# EasyEDA Pro project card.epro

# Schematic Schematic1
Board Name: Board1; Create Date: 2024-08-14; Page Name: P1; Project Name: nfc card; Schematic Name: Schematic1; Update Date: 2025-07-19; Company: EasyEDA.com; Drawn: EasyEDA; Page Size: A4; Part Number: JLCPCB-002; Reviewed: EasyEDA; Version: V0.1
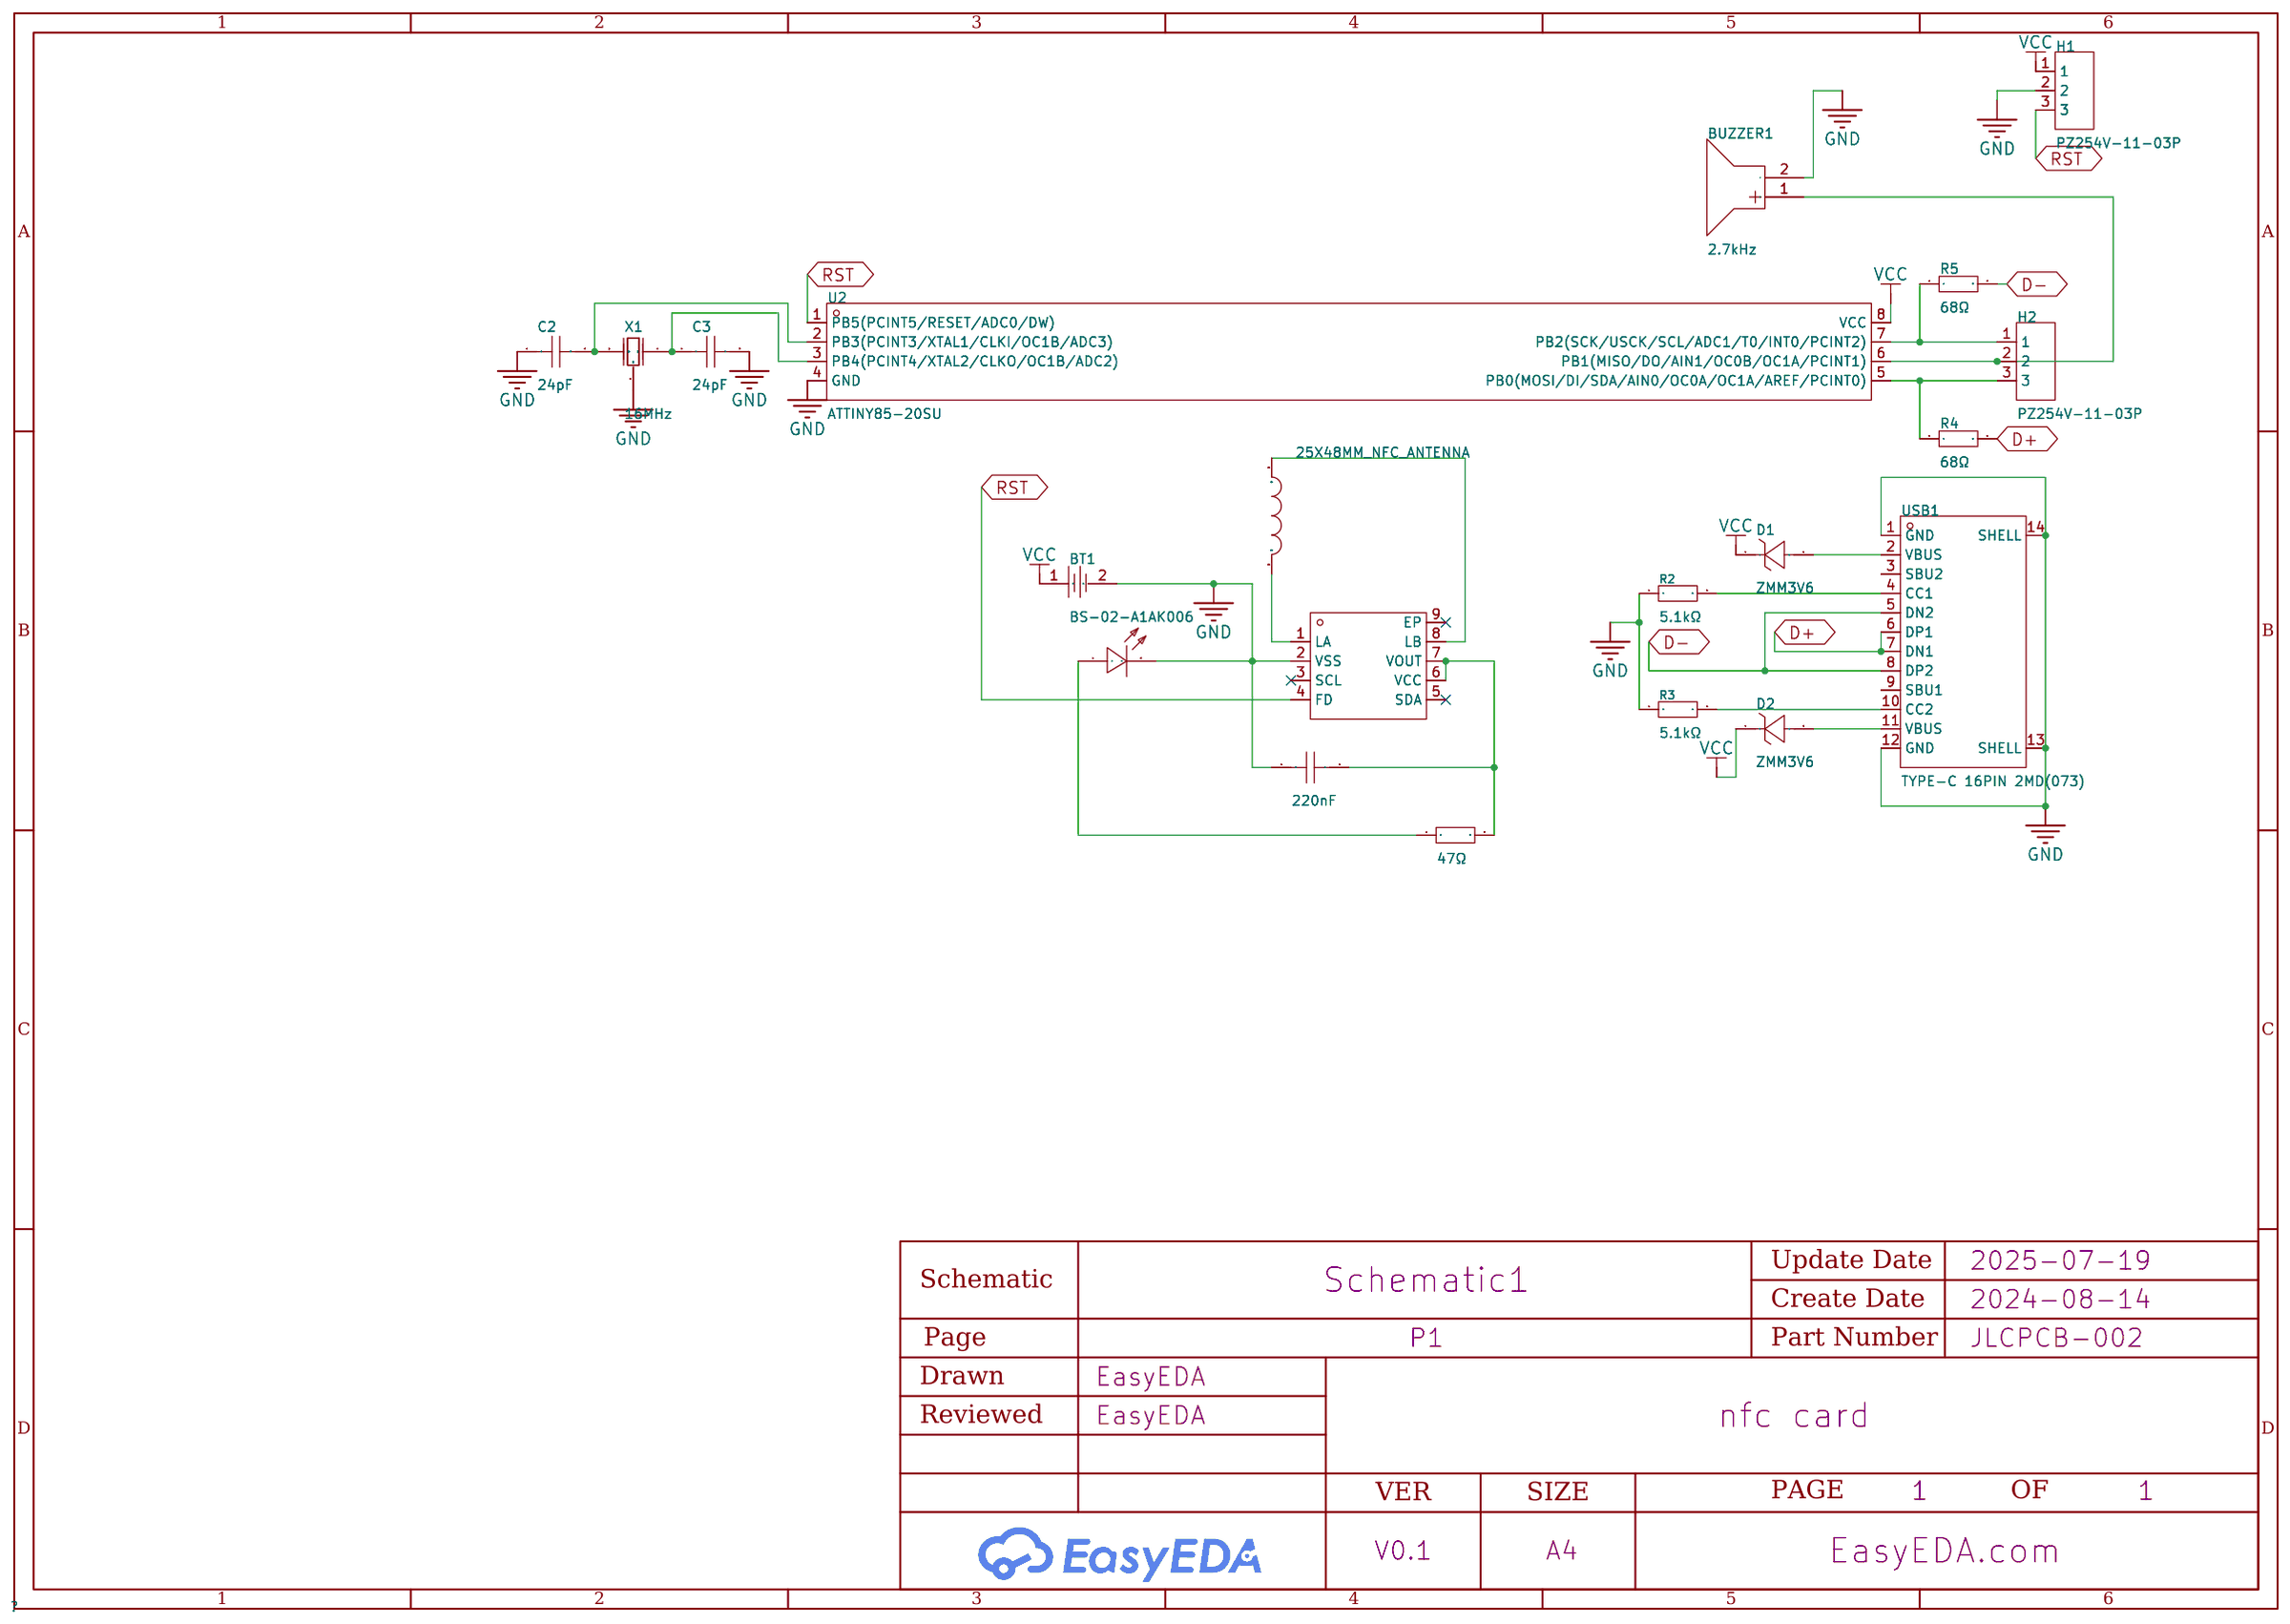
[diagram p0: schematic sheet]

## Parts
1  25X48MM_NFC_ANTENNA  [13.56MHZ CLASS 6 NFC ANTENNA]
BT1  BS-02-A1AK006  [BAT-TH_BS-02-A1AK006]
BUZZER1  2.7kHz  [BUZ-SMD_L9.6-W9.6-LS10.0-R]
C1  100nF  [C0805]
C2  24pF  [C0402]
C3  24pF  [C0402]
D1  ZMM3V6  [LL-34_L3.5-W1.5-RD]
D2  ZMM3V6  [LL-34_L3.5-W1.5-RD]
H1  PZ254V-11-03P  [HDR-TH_3P-P2.54-V-M]
H2  PZ254V-11-03P  [HDR-TH_3P-P2.54-V-M]
LED1  KT-0805YG  [LED0805-R-RD]
R1  47  [R0805]
R2  5.1kΩ  [R0402]
R3  5.1kΩ  [R0402]
R4  68Ω  [R0402]
R5  68Ω  [R0402]
U1  13.56MHz  [XQFN-8_L1.6-W1.6-P0.50-BL]
U2  ATTINY85-20SU  [SOIC-8_L5.3-W5.3-P1.27-LS8.0-BL]
USB1  TYPE-C 16PIN 2MD(073)  [USB-C-SMD_TYPE-C-6PIN-2MD-073]
X1  16MHz  [OSC-SMD_3P-L3.2-W1.3-P1.2-L]

## Library data of the parts
1 = 25X48MM_NFC_ANTENNA
BT1 = BS-02-A1AK006: Connector Type:Battery holder Battery Type:CR2032 Contact Material:Phosphor Bronze Contact Plating:Tin Operating Temperature Range:-25℃~+85℃ Operating Temperature Range:-25℃~+85℃; LCSC Part Name: 电池底座 适用电池:CR2032; Supplier Part: C964746; Manufacturer: MYOUNG(美阳); Supplier Footprint: 插件; JLCPCB Part Class: Extended Part; Datasheet: https://atta.szlcsc.com/upload/public/pdf/source/20201218/C964746_D636BD2F273EEE7B636B6EF7E90F8FC5.pdf; Supplier: LCSC; Connector Type: Battery holder; Battery Type: CR2032; Contact Material: Phosphor Bronze; Contact Plating: Tin; Operating Temperature Range: -25℃~+85℃
BUZZER1 = YS-SBZ9650DYB05: Driver Circuitry:Active (Built-in Driver Circuit) Voltage - Supply:3V~7V Voltage - Supply:3V~7V Frequency:2.7kHz Sound Pressure Level(SPL):80dB Length:9.6mm Width:9.6mm Height:5.3mm; LCSC Part Name: 贴片有源蜂鸣器5V; Supplier Part: C409830; Manufacturer: Fengming(锋鸣电子); Supplier Footprint: SMD,9.6x9.6mm; JLCPCB Part Class: Extended Part; Datasheet: https://atta.szlcsc.com/upload/public/pdf/source/20191217/C409830_8EC3C70066086F723D62F9967ED58A07.pdf; Supplier: LCSC; Driver Circuitry: Active (Built-in Driver Circuit); Voltage - Supply: 3V~7V; Sound Pressure Level(SPL): 80dB; Length: 9.6mm; Width: 9.6mm; Height: 5.3mm
C1 = C0805B104K500NT: Capacitance: Tolerance:±10% Tolerance:±10% Voltage Rated: Temperature Coefficient:; LCSC Part Name: 100nF ±10% 50V; Supplier Part: C476766; Manufacturer: TORCH(火炬); Supplier Footprint: 0805; JLCPCB Part Class: Extended Part; Datasheet: https://atta.szlcsc.com/upload/public/pdf/source/20191230/C476766_171E30D5B7F7164A8210B8E948DFBAE0.pdf; Supplier: LCSC; Tolerance: ±10%
C2 C3 = GJM1555C1H240JB01D: Capacitance:24pF Tolerance:±5% Tolerance:±5% Voltage Rating:50V Temperature Coefficient:C0G; LCSC Part Name: 24pF ±5% 50V; Supplier Part: C2177214; Manufacturer: muRata(村田); Supplier Footprint: 0402; JLCPCB Part Class: Extended Part; Datasheet: https://atta.szlcsc.com/upload/public/pdf/source/20210607/534E2E01BE80A639A99B2BE48B9686B1.pdf; Supplier: LCSC; Tolerance: ±5%; Voltage Rating: 50V; Temperature Coefficient: C0G
D1 D2 = ZMM3V6_C2985635: Diode Configuration:Independent Type Zener Voltage(Nom):3.6V Reverse Leakage Current (Ir):2uA@1V Zener Voltage(Range):3.4V~3.8V Zener Voltage(Range):3.4V~3.8V Pd - Power Dissipation:500mW Impedance(Zzt):85Ω; Supplier Part: C2985635; Manufacturer: YONGYUTAI(永裕泰); Supplier Footprint: LL-34; JLCPCB Part Class: Extended Part; Datasheet: https://atta.szlcsc.com/upload/public/pdf/source/20210901/1E62BEB6ADBB84BC625F53DAC2865793.pdf; Supplier: LCSC; Diode Configuration: Independent Type; Zener Voltage(Nom): 3.6V; Reverse Leakage Current (Ir): 2uA@1V; Zener Voltage(Range): 3.4V~3.8V; Pd - Power Dissipation: 500mW; Impedance(Zzt): 85Ω
H1 H2 = PZ254V-11-03P_C492402: Pin Structure:1x3P Pitch:2.54mm Row Spacing:- Circluar Pins/Square Pins:Policy Mounting Type:Straight Number of Rows:Single Row Number of Pins:3P Current Rating:- Voltage Rating (Max):- Length of Mating Pin:6mm Insulation Height:2.5mm Length of End Connec; LCSC Part Name: 1x3P 间距:2.54mm 方针 直插; Supplier Part: C492402; Manufacturer: XFCN(兴飞); Supplier Footprint: 插件,P=2.54mm; JLCPCB Part Class: Extended Part; Datasheet: https://atta.szlcsc.com/upload/public/pdf/source/20200309/C492402_8335C3D49C4E4C618838D59BB1D024C1.pdf; Supplier: LCSC; Pin Structure: 1x3P; Pitch: 2.54mm; Circluar Pins/Square Pins: Policy; Mounting Type: Straight; Number of Rows: Single Row; Number of Pins: 3P; Length of Mating Pin: 6mm; Insulation Height: 2.5mm; Length of End Connection Pin: 3mm; Contact Material: Brass; Operating Temperature: -40℃~+105℃; Color: Black
LED1 = KT-0805YG: Emitted Color:Green-yellow; LCSC Part Name: 0805 黄绿 普绿; Supplier Part: C2292; Manufacturer: KENTO; Supplier Footprint: 0805; JLCPCB Part Class: Extended Part; Datasheet: https://atta.szlcsc.com/upload/public/pdf/source/20161024/1477287943397.pdf; Supplier: LCSC; Emitted Color: Green-yellow
R1 = 0805W8F1002T5E: Type:Thick Film Resistors Resistance:10kΩ Tolerance:±1% Tolerance:±1% Power(Watts): Overload Voltage (Max): Temperature Coefficient:±100ppm/℃ Temperature Coefficient:±100ppm/℃ Operating Temperature Range:-55℃~+155℃ Operating Temperature Range:-55℃~+155℃; LCSC Part Name: 10kΩ ±1% 125mW 厚膜电阻; Supplier Part: C17414; Manufacturer: UNI-ROYAL(厚声); Supplier Footprint: 0805; JLCPCB Part Class: Basic Part; Datasheet: https://atta.szlcsc.com/upload/public/pdf/source/20200306/C422600_1E6D84923E4A46A82E41ADD87F860B5C.pdf; Supplier: LCSC; Type: Thick Film Resistors; Tolerance: ±1%; Temperature Coefficient: ±100ppm/℃; Operating Temperature Range: -55℃~+155℃
R2 R3 = 0402WGF5101TCE: Type:Thick Film Resistors Resistance:5.1kΩ Tolerance:±1% Tolerance:±1% Power(Watts): Overload Voltage (Max): Temperature Coefficient:±100ppm/℃ Temperature Coefficient:±100ppm/℃ Operating Temperature Range:-55℃~+155℃ Operating Temperature Range:-55℃~+155℃; LCSC Part Name: 5.1kΩ ±1% 62.5mW 厚膜电阻; Supplier Part: C25905; Manufacturer: UNI-ROYAL(厚声); Supplier Footprint: 0402; JLCPCB Part Class: Basic Part; Datasheet: https://atta.szlcsc.com/upload/public/pdf/source/20200306/C422600_1E6D84923E4A46A82E41ADD87F860B5C.pdf; Supplier: LCSC; Type: Thick Film Resistors; Tolerance: ±1%; Temperature Coefficient: ±100ppm/℃; Operating Temperature Range: -55℃~+155℃
R4 R5 = RC0402FR-0768RL: Type:Thick Film Resistors Resistance: Tolerance:±1% Tolerance:±1% Power(Watts): Overload Voltage (Max): Temperature Coefficient:±100ppm/℃ Temperature Coefficient:±100ppm/℃ Operating Temperature Range:-55℃~+155℃ Operating Temperature Range:-55℃~+155℃; LCSC Part Name: 厚膜电阻 68Ω ±1% 62.5mW; Supplier Part: C163455; Manufacturer: YAGEO(国巨); Supplier Footprint: 0402; JLCPCB Part Class: Extended Part; Datasheet: https://atta.szlcsc.com/upload/public/pdf/source/20181009/C309620_DA5935B6E1D48212CB7A533FE518B3C2.pdf; Supplier: LCSC; Type: Thick Film Resistors; Tolerance: ±1%; Temperature Coefficient: ±100ppm/℃; Operating Temperature Range: -55℃~+155℃
U1 = NT3H2111W0FHKH: agreement:ISO 14443 interface type:I2C Frequency:13.56MHz Frequency:13.56MHz mains input:3.3V mains input:3.3V; Supplier Part: C710403; Manufacturer: NXP(恩智浦); Supplier Footprint: XQFN-8(1.6x1.6); JLCPCB Part Class: Extended Part; Datasheet: https://atta.szlcsc.com/upload/public/pdf/source/20231222/0CA007C5B9F698A9424BFDC383BAA79D.pdf; Supplier: LCSC; agreement: ISO 14443; interface type: I2C; mains input: 3.3V
U2 = ATTINY85-20SU_C31540447: Supplier Part: C31540447; Manufacturer: MICROCHIP(美国微芯); Supplier Footprint: SOIC-8-208mil; JLCPCB Part Class: Extended Part; Datasheet: https://atta.szlcsc.com/upload/public/pdf/source/20220128/C2054451_C9B4ABB36EE91A4310FC2804A278EDC5.pdf; Supplier: LCSC
USB1 = TYPE-C 16PIN 2MD(073): Connector Type:Type-C Protocol Standard:USB 3.1 Gender:Female Mounting Type:Surface Mount, Right Angle Number of Contacts:16P Number of Ports:1 Current Rating-Power:3A Voltage Rating:5V Connect-Disconnect Life:5,000 Cycles Supplementary Features:- Center; LCSC Part Name: Type-C 母 卧贴; Supplier Part: C2765186; Manufacturer: SHOU HAN(首韩); Supplier Footprint: SMD; JLCPCB Part Class: Extended Part; Datasheet: https://atta.szlcsc.com/upload/public/pdf/source/20250506/FFB74EDFDFA0AC372CE4A8E4F739CCEF.pdf; Supplier: LCSC; Connector Type: Type-C; Protocol Standard: USB 3.1; Gender: Female; Mounting Type: Surface Mount, Right Angle; Number of Contacts: 16P; Number of Ports: 1; Current Rating-Power: 3A; Voltage Rating: 5V; Connect-Disconnect Life: 5,000 Cycles; Detection color: Black; Operating Temperature: -25℃~+85℃
X1 = CSTNE16M0V530000R0: Frequency: Built-in Load Capacitance: Resonant Impedance: Operating Temperature:-40℃~+85℃ Operating Temperature:-40℃~+85℃; LCSC Part Name: 16MHz ±0.5% 内置负载电容:15pF; Supplier Part: C341521; Manufacturer: muRata(村田); Supplier Footprint: SMD3213-3P; JLCPCB Part Class: Extended Part; Datasheet: https://atta.szlcsc.com/upload/public/pdf/source/20181211/C341521_3DF77211002AAEDE8E1FD920A512C1E4.pdf; Supplier: LCSC; Operating Temperature: -40℃~+85℃

## Nets
GND: BT1.2 BUZZER1.2(-) C1.1 C2.1 C3.2 H1.2 LED1.2(K) R2.1 R3.1 U1.2(VSS) U2.4(GND) USB1.1(GND) USB1.12(GND) USB1.13(SHELL) USB1.14(SHELL) X1.2(GND)
VCC: BT1.1 D1.1(K) D2.1(K) H1.1 U2.8(VCC)
D+: R4.2 USB1.6(DP1) USB1.7(DN1)
D-: R5.2 USB1.5(DN2) USB1.8(DP2)
RST: H1.3 U1.4(FD) U2.1(PB5(PCINT5/RESET/ADC0/DW))
$1N496: C1.2 R1.2 U1.6(VCC) U1.7(VOUT)
$1N587: LED1.1(A) R1.1
$1N1320: C2.2 U2.2(PB3(PCINT3/XTAL1/CLKI/OC1B/ADC3)) X1.3(OSC2)
$1N1390: C3.1 U2.3(PB4(PCINT4/XTAL2/CLKO/OC1B/ADC2)) X1.1(OSC1)
$1N2133: H2.1 R5.1 U2.7(PB2(SCK/USCK/SCL/ADC1/T0/INT0/PCINT2))
$1N2139: BUZZER1.1(+) H2.2 U2.6(PB1(MISO/DO/AIN1/OC0B/OC1A/PCINT1))
$1N2427: D1.2(A) USB1.2(VBUS)
$1N2465: D2.2(A) USB1.11(VBUS)
$1N2504: R2.2 USB1.4(CC1)
$1N2543: R3.2 USB1.10(CC2)
$1N2776: H2.3 R4.1 U2.5(PB0(MOSI/DI/SDA/AIN0/OC0A/OC1A/AREF/PCINT0))
Net-(1-P$1): 1.P$1 U1.8(LB)
Net-(1-P$2): 1.P$2 U1.1(LA)

Not connected (* = marked no-connect by the designer): U1 3(SCL)* 5(SDA)* 9(EP)*; USB1 3(SBU2) 9(SBU1)

# Board PCB1
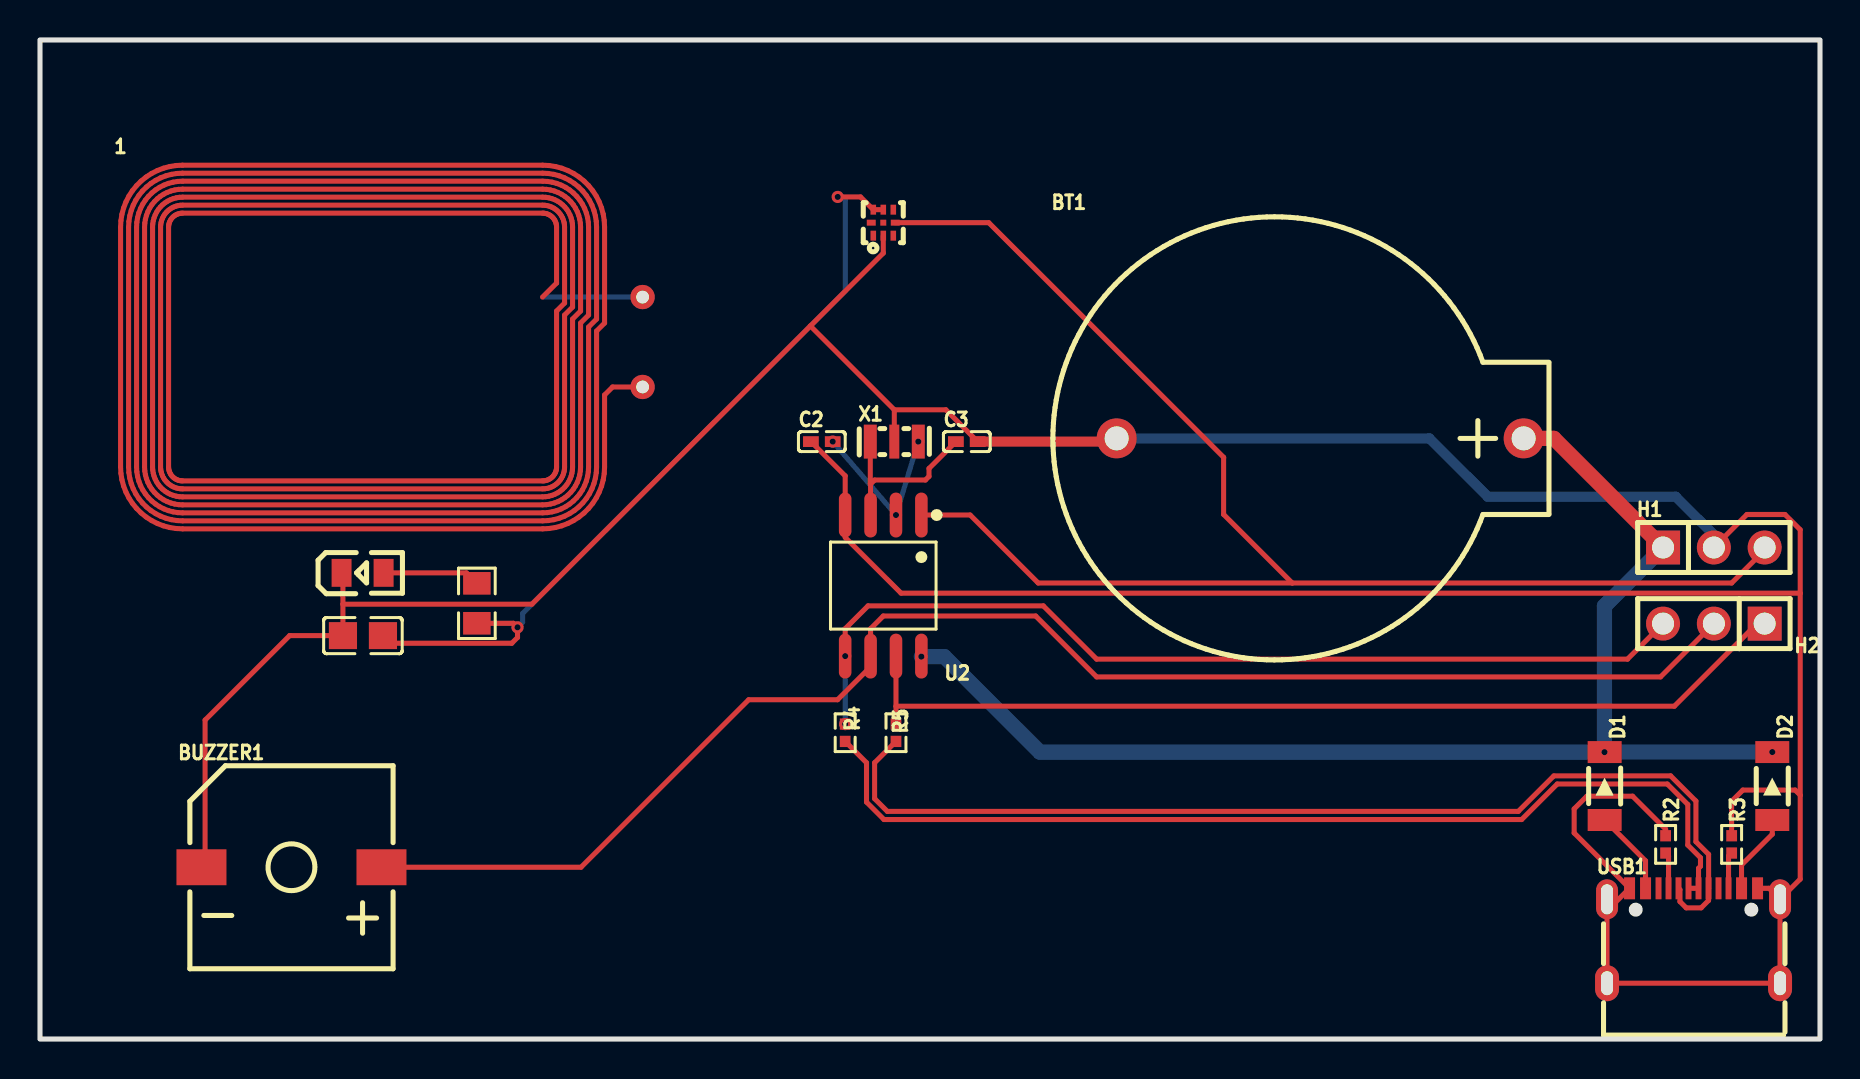
[diagram p1: board, top side]
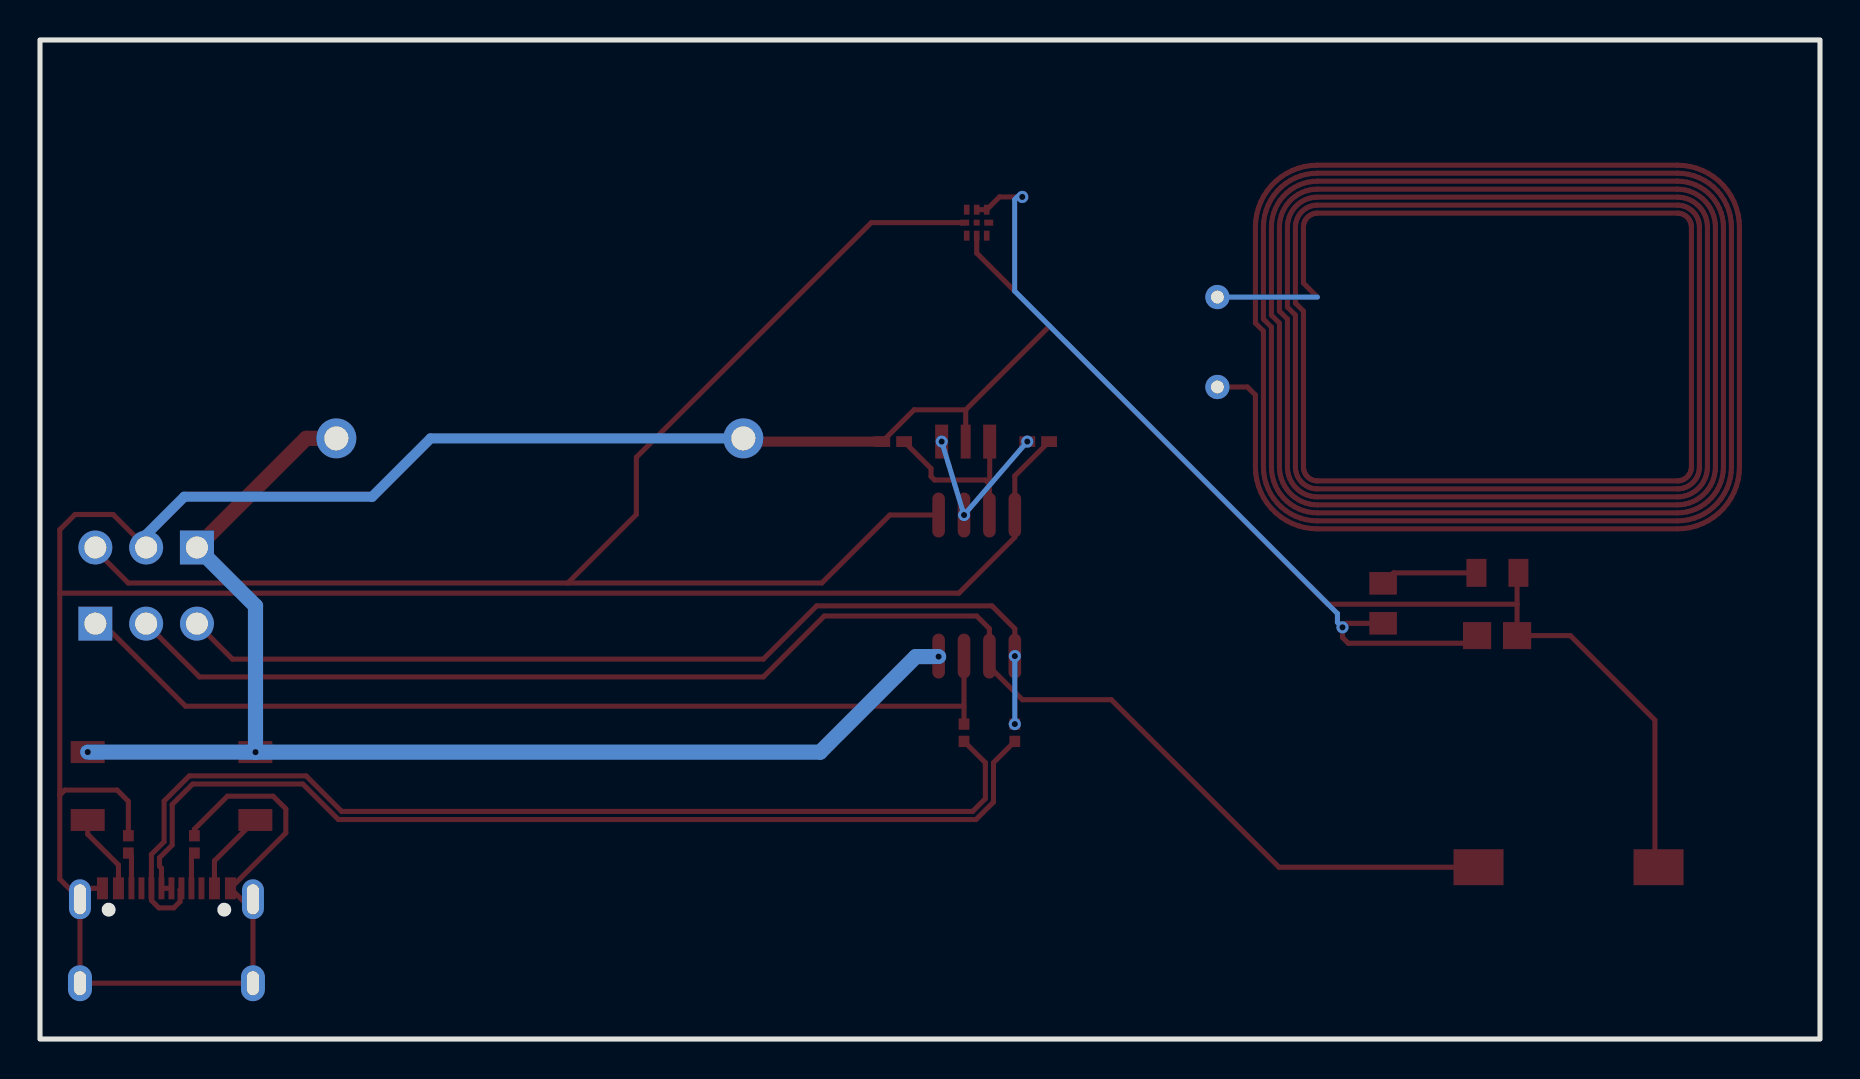
[diagram p2: board, bottom side, seen from below]

Outline 89 x 50 mm; copper layers: Top Layer, Bottom Layer. Coordinates in mm from the lower left corner of the outline.
Outline path: rectangle 0,50 89,0
Stack: Top Layer 0.035mm / Dielectric1 1.51mm FR4 er 4.5 / Bottom Layer 0.035mm

## Design rules (mm)
net D+: D
net D-: D
template: JLCPCB Capability(Two Layers Board)
spacing copperThickness1oz (default): track to track 0.102, other pairs 0.152 to 0.3
spacing copperThickness2oz: track to track 0.203, other pairs 0.152 to 0.3
track width copperThickness1oz (default): min 0.127, default 0.254, max 2.54
track width copperThickness2oz: min 0.203, default 0.254, max 2.54
differential pair differentialPair (default): width min 0.127, default 0.254, max 2.54; gap min 0.152, default 0.152
via viaSize (default): diameter min 0.5, default 0.61, max 10; hole min 0.3, default 0.305, max 6.3

## Placement (name value [footprint] x y rotation side)
1  25X48MM_NFC_ANTENNA  [13.56MHZ CLASS 6 NFC ANTENNA]  16.13 34.63 0 top
BT1  BS-02-A1AK006  [BAT-TH_BS-02-A1AK006]  64.01 30.06 0 top
BUZZER1  2.7kHz  [BUZ-SMD_L9.6-W9.6-LS10.0-R]  12.57 8.6 0 top
C1  100nF  [C0805]  16.15 20.19 0 top
C2  24pF  [C0402]  39.09 29.9 0 top
C3  24pF  [C0402]  46.34 29.9 0 top
D1  ZMM3V6  [LL-34_L3.5-W1.5-RD]  78.23 12.66 270 top
D2  ZMM3V6  [LL-34_L3.5-W1.5-RD]  86.61 12.66 270 top
H1  PZ254V-11-03P  [HDR-TH_3P-P2.54-V-M]  83.69 24.6 0 top
H2  PZ254V-11-03P  [HDR-TH_3P-P2.54-V-M]  83.69 20.79 180 top
LED1  KT-0805YG  [LED0805-R-RD]  16.13 23.33 0 top
R1  47  [R0805]  21.84 21.81 270 top
R2  5.1kΩ  [R0402]  81.28 9.74 270 top
R3  5.1kΩ  [R0402]  84.58 9.74 270 top
R4  68Ω  [R0402]  40.26 15.33 270 top
R5  68Ω  [R0402]  42.8 15.33 270 top
U1  13.56MHz  [XQFN-8_L1.6-W1.6-P0.50-BL]  42.16 40.86 0 top
U2  ATTINY85-20SU  [SOIC-8_L5.3-W5.3-P1.27-LS8.0-BL]  42.16 22.69 180 top
USB1  TYPE-C 16PIN 2MD(073)  [USB-C-SMD_TYPE-C-6PIN-2MD-073]  82.68 5.17 0 top
X1  16MHz  [OSC-SMD_3P-L3.2-W1.3-P1.2-L]  42.72 29.9 0 top

## Footprints (pads in the part's own frame, mm; a bottom-side part is the same pattern mirrored in y, then rotated)
13.56MHZ CLASS 6 NFC ANTENNA
  round 1.219 hole 0.635: 1(14,-2) 2(14,2.5)
BAT-TH_BS-02-A1AK006
  round 2 hole 1.2: 1(10.175,0) 2(-10.175,0)
BUZ-SMD_L9.6-W9.6-LS10.0-R
  rect 2.5x1.8 smd: 1(4.5,0) 2(-4.5,0)
C0402
  rect 0.79x0.54 smd: 1(-0.545,0) 2(0.545,0)
C0805
  rect 1.41x1.35 smd: 1(-1,0) 2(1,0)
HDR-TH_3P-P2.54-V-M
  rect 1.7x1.7 hole 1.1: 1(-2.54,0)
  round 1.7 hole 1.1: 2(0,0) 3(2.54,0)
LED0805-R-RD
  rect 1x1.399 smd: 1(1.05,0) 2(-1.05,0)
LL-34_L3.5-W1.5-RD
  rect 1.1x1.7 smd: 1(-1.7,0) 2(1.7,0)
OSC-SMD_3P-L3.2-W1.3-P1.2-L
  rect 0.65x1.7 smd: 1(-1.2,0) 3(1.2,0)
  rect 0.5x1.7 smd: 2(0,0)
R0402
  rect 0.566x0.54 smd: 1(-0.433,0) 2(0.433,0)
R0805
  rect 1.133x1.377 smd: 1(-1,0) 2(1,0)
SOIC-8_L5.3-W5.3-P1.27-LS8.0-BL
  oval 0.63x2.25 smd: 1(-1.905,-3.53) 2(-0.635,-3.53) 3(0.635,-3.53) 4(1.905,-3.53) 5(1.905,3.53) 6(0.635,3.53) 7(-0.635,3.53) 8(-1.905,3.53)
USB-C-SMD_TYPE-C-6PIN-2MD-073
  rect 0.55x1.1 smd: 1(-3.2,2.375) 2(-2.4,2.375) 11(2.4,2.375) 12(3.2,2.375)
  rect 0.3x1.1 smd: 3(-1.75,2.375) 4(-1.25,2.375) 5(-0.75,2.375) 6(-0.25,2.375) 7(0.25,2.375) 8(0.75,2.375) 9(1.25,2.375) 10(1.75,2.375)
  oval 1.1x2 hole 0.6x1.5: 13(-4.325,1.825) 14(4.325,1.825)
  oval 1.2x1.8 hole 0.6x1.2: 13(-4.325,-2.375) 14(4.325,-2.375)
XQFN-8_L1.6-W1.6-P0.50-BL
  rect 0.28x0.5 smd: 1(-0.5,-0.65) 2(0,-0.65) 3(0.5,-0.65) 5(0.5,0.65) 6(0,0.65) 7(-0.5,0.65)
  rect 0.45x0.3 smd: 4(0.6,0) 8(-0.6,0)
  rect 0.3x0.3 smd: 9(0,0)

## Nets
As in the schematic.

Pads without a net: 1 1 2; U1 3 5 9; USB1 3 9

## Via types
v1: diameter 0.61, hole 0.305, Top Layer to Bottom Layer, 10 vias

## Routing (per net, layer and track width the routed paths; a pad name or vN(x,y) marks a point on that pad's centre or on a via; arc(x,y) is an arc through that point)
GND: length 221.6
  Top Layer w0.254: X1.2 42.72,31.49 ; 42.72,31.49 45.29,31.49 C3.2 ; 42.72,31.49 38.52,35.69 ; 88.01,22.31 88.01,25.49 87.25,26.25 85.34,26.25 H1.2 ; 88.01,22.31 88.01,12.21 ; 88.01,22.31 43.05,22.31 40.26,25.11 U2.4 40.26,28.19 C2.1 ; 78.35,6.66 78.59,6.66 USB1.1 76.71,10.31 76.71,11.52 77.34,12.15 79.63,12.15 81.28,10.5 R2.1 ; 78.35,6.66 USB1.13 USB1.14 87,6.99 ; 78.35,6.66 78.35,6.99 ; U1.2 42.16,39.33 38.52,35.69 ; 38.52,35.69 24.59,21.76 15.15,21.76 ; R3.1 84.58,11.9 85.14,12.46 87.76,12.46 88.01,12.21 ; USB1.12 86.45,7.54 87,6.99 ; 88.01,12.21 88.01,8 87,6.99 ; LED1.2 15.15,23.26 15.15,21.76 ; 15.15,21.76 C1.1 12.48,20.19 8.26,15.96 8.26,8.78 BUZZER1.2
  Top Layer w0.508: C3.2 54.18,29.9
  Bottom Layer w0.508: H1.2 83.69,25.23 81.79,27.14 72.39,27.14 69.47,30.06 BT1.2
VCC: length 65.2
  Top Layer w0.762: BT1.1 75.69,30.06 81.15,24.6
  Bottom Layer w0.762: 81.15,24.6 78.22,21.67 v1(78.22,14.36) ; v1(44.07,19.14) 45.21,19.14 49.99,14.36 v1(78.22,14.36) ; v1(78.22,14.36) 78.23,14.36 v1(86.61,14.36)
D+: length 51.1
  Top Layer w0.254: R4.2 41.33,13.83 41.33,11.86 42.2,10.99 74.08,10.99 75.86,12.76 81.37,12.76 82.39,11.74 82.39,9.71 83.02,9.07 83.02,8.65 82.93,8.55 USB1.7 USB1.6
D-: length 53.5
  Top Layer w0.254: R5.2 41.73,13.83 41.73,12.03 42.37,11.39 73.91,11.39 75.69,13.17 81.53,13.17 82.8,11.91 82.8,9.88 83.43,9.24 83.43,7.55 USB1.8 83.43,6.93 83.06,6.57 82.31,6.57 82,6.88 82,7.47 USB1.5
RST: length 73.4
  Top Layer w0.254: U2.1 46.51,26.22 49.91,22.82 62.61,22.82 ; 62.61,22.82 59.18,26.25 59.18,29.11 47.44,40.86 U1.4 ; 62.61,22.82 84.58,22.82 86.23,24.47 H1.3
$1N496: length 40.8
  Top Layer w0.254: v1(39.89,42.14) 41.03,42.14 41.66,41.51 42.16,41.51 ; R1.2 23.67,20.81 v1(23.88,20.6) 23.88,20.1 23.59,19.81 17.53,19.81 C1.2
  Bottom Layer w0.254: v1(23.88,20.6) 24.13,20.86 24.13,21.3 40.27,37.43 40.27,42.02 40.14,42.14 v1(39.89,42.14)
$1N587: length 4.9
  Top Layer w0.254: R1.1 21.32,23.33 LED1.1
$1N1320: length 8.7
  Bottom Layer w0.254: v1(39.64,29.9) 39.65,29.88 v1(42.8,26.22) v1(43.92,29.9)
$1N1390: length 9.1
  Top Layer w0.254: C3.1 44.45,28.55 44.45,28.16 44.27,27.98 41.73,27.98 41.53,27.77 ; 41.53,27.77 41.53,26.22 ; 41.53,27.77 41.52,27.79 X1.1
$1N2133: length 48.5
  Top Layer w0.254: 42.8,16.66 U2.7 ; 42.8,16.66 81.72,16.66 85.85,20.79 H2.1 ; 42.8,16.66 42.8,15.76
$1N2139: length 75.3
  Top Layer w0.254: BUZZER1.1 27.05,8.6 35.43,16.98 39.88,16.98 41.53,18.63 41.53,20.54 42.16,21.17 49.78,21.17 52.83,18.12 81.03,18.12 H2.2
$1N2427: length 4.3
  Top Layer w0.254: USB1.2 80.28,8.92 D1.2
$1N2465: length 4.1
  Top Layer w0.254: D2.2 86.61,10.25 85.08,8.71 USB1.11
$1N2504: length 1.8
  Top Layer w0.254: 81.28,9.31 81.43,9.16 USB1.4
$1N2543: length 1.8
  Top Layer w0.254: USB1.10 84.43,9.15 84.58,9.31
$1N2776: length 48
  Top Layer w0.254: 81.15,20.79 79.38,19.01 52.83,19.01 50.16,21.68 41.4,21.68 40.26,20.54 v1(40.26,19.16)
  Bottom Layer w0.254: v1(40.26,19.16) v1(40.26,15.76)
